# EAGLE design Data_Board_4_Panel (EAGLE 9.6.0)
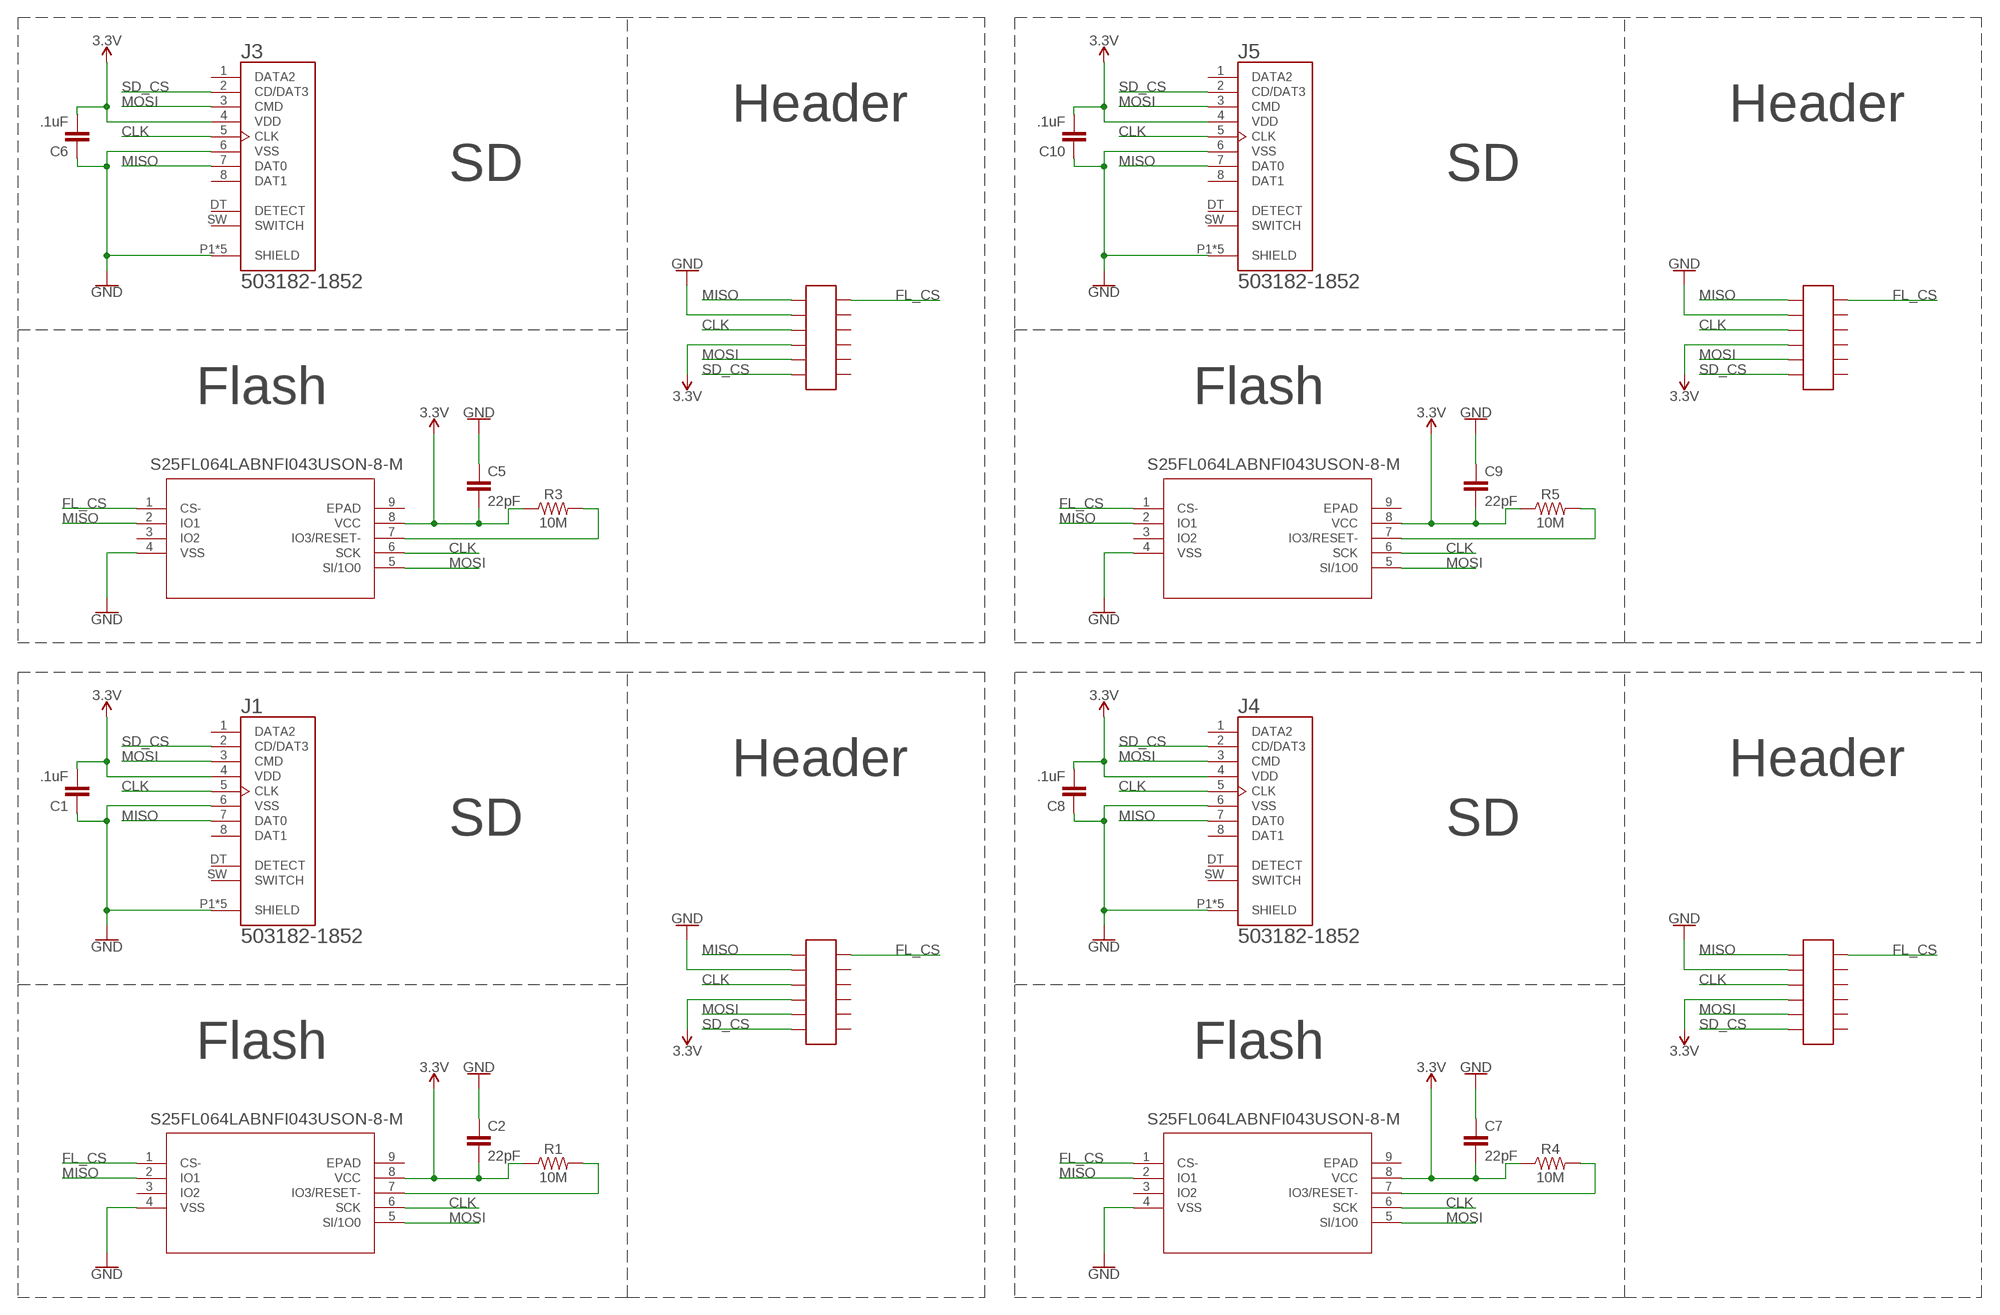
[diagram p0: schematic, sheet 1]

## Parts
C1  .1uF  10NF-0603-50V-10%  [0603]
C2  22pF  10NF-0603-50V-10%  [0603]
C5  22pF  10NF-0603-50V-10%  [0603]
C6  .1uF  10NF-0603-50V-10%  [0603]
C7  22pF  10NF-0603-50V-10%  [0603]
C8  .1uF  10NF-0603-50V-10%  [0603]
C9  22pF  10NF-0603-50V-10%  [0603]
C10  .1uF  10NF-0603-50V-10%  [0603]
J1  503182-1852  [MOLEX_503182-1852]
J3  503182-1852  [MOLEX_503182-1852]
J4  503182-1852  [MOLEX_503182-1852]
J5  503182-1852  [MOLEX_503182-1852]
R1  10M  220KOHM-0603-1/10W-1%  [0603]
R3  10M  220KOHM-0603-1/10W-1%  [0603]
R4  10M  220KOHM-0603-1/10W-1%  [0603]
R5  10M  220KOHM-0603-1/10W-1%  [0603]
U1  S25FL064LABNFI043USON-8-M  [USON-8-M]
U3  S25FL064LABNFI043USON-8-M  [USON-8-M]
U4  S25FL064LABNFI043USON-8-M  [USON-8-M]
U5  S25FL064LABNFI043USON-8-M  [USON-8-M]
U$1  12POS_HEADER  [12POS_HEADER]
U$3  12POS_HEADER  [12POS_HEADER]
U$4  12POS_HEADER  [12POS_HEADER]
U$5  12POS_HEADER  [12POS_HEADER]

## Nets
3.3V: C1.2 C2.2 C5.2 C6.2 C7.2 C8.2 C9.2 C10.2 J1.4(VDD) J3.4(VDD) J4.4(VDD) J5.4(VDD) R1.1 R3.1 R4.1 R5.1 U1.8(VCC) U3.8(VCC) U4.8(VCC) U5.8(VCC) U$1.P$4 U$3.P$4 U$4.P$4 U$5.P$4
CLK: J1.5(CLK) J3.5(CLK) J4.5(CLK) J5.5(CLK) U1.6(SCK) U3.6(SCK) U4.6(SCK) U5.6(SCK) U$1.P$3 U$3.P$3 U$4.P$3 U$5.P$3
FL_CS: U1.1(CS-) U3.1(CS-) U4.1(CS-) U5.1(CS-) U$1.P$12 U$3.P$12 U$4.P$12 U$5.P$12
GND: C1.1 C2.1 C5.1 C6.1 C7.1 C8.1 C9.1 C10.1 J1.6(VSS) J1.P1(SHIELD) J1.P2(SHIELD) J1.P3(SHIELD) J1.P4(SHIELD) J1.P5(SHIELD) J3.6(VSS) J3.P1(SHIELD) J3.P2(SHIELD) J3.P3(SHIELD) J3.P4(SHIELD) J3.P5(SHIELD) J4.6(VSS) J4.P1(SHIELD) J4.P2(SHIELD) J4.P3(SHIELD) J4.P4(SHIELD) J4.P5(SHIELD) J5.6(VSS) J5.P1(SHIELD) J5.P2(SHIELD) J5.P3(SHIELD) J5.P4(SHIELD) J5.P5(SHIELD) U1.4(VSS) U3.4(VSS) U4.4(VSS) U5.4(VSS) U$1.P$2 U$3.P$2 U$4.P$2 U$5.P$2
MISO: J1.7(DAT0) J3.7(DAT0) J4.7(DAT0) J5.7(DAT0) U1.2(IO1) U3.2(IO1) U4.2(IO1) U5.2(IO1) U$1.P$1 U$3.P$1 U$4.P$1 U$5.P$1
MOSI: J1.3(CMD) J3.3(CMD) J4.3(CMD) J5.3(CMD) U1.5(SI/1O0) U3.5(SI/1O0) U4.5(SI/1O0) U5.5(SI/1O0) U$1.P$5 U$3.P$5 U$4.P$5 U$5.P$5
N$2: R3.2 U3.7(IO3/RESET-)
N$3: R4.2 U4.7(IO3/RESET-)
N$4: R5.2 U5.7(IO3/RESET-)
N$6: R1.2 U1.7(IO3/RESET-)
SD_CS: J1.2(CD/DAT3) J3.2(CD/DAT3) J4.2(CD/DAT3) J5.2(CD/DAT3) U$1.P$6 U$3.P$6 U$4.P$6 U$5.P$6
Unconnected: J1.1(DATA2) J1.8(DAT1) J1.DT(DETECT) J1.SW(SWITCH) J3.1(DATA2) J3.8(DAT1) J3.DT(DETECT) J3.SW(SWITCH) J4.1(DATA2) J4.8(DAT1) J4.DT(DETECT) J4.SW(SWITCH) J5.1(DATA2) J5.8(DAT1) J5.DT(DETECT) J5.SW(SWITCH) U1.3(IO2) U1.9(EPAD) U3.3(IO2) U3.9(EPAD) U4.3(IO2) U4.9(EPAD) U5.3(IO2) U5.9(EPAD) U$1.P$7 U$1.P$8 U$1.P$9 U$1.P$10 U$1.P$11 U$3.P$7 U$3.P$8 U$3.P$9 U$3.P$10 U$3.P$11 U$4.P$7 U$4.P$8 U$4.P$9 U$4.P$10 U$4.P$11 U$5.P$7 U$5.P$8 U$5.P$9 U$5.P$10 U$5.P$11

## Notes on the sheet
- Header | Header
- SD | SD
- Flash | Flash
- Header | Header
- SD | SD
- Flash | Flash

## Library data of the parts
C1 C2 C5-C10 = SparkFun-Capacitors:10NF: 0.01uF/10nF/10,000pF ceramic capacitors A capacitor is a passive two-terminal electrical component used to store electrical energy temporarily in an electric field. CAP-09321; PROD_ID: CAP-00867; VALUE: 10nF
J1 J3-J5 = 503182-1852:503182-1852: Conn Micro SD Card M 8 POS 1.09mm Solder RA SMD Embossed T/R 0.5A/Contact; DESCRIPTION: 10 (8 + 2) Position Card Connector microSD™ Surface Mount, Right Angle Gold; DIGI-KEY_PART_NUMBER: WM12834CT-ND; MF: Molex; MP: 5031821852; PACKAGE: None; PURCHASE-URL: https://pricing.snapeda.com/search/part/5031821852/?ref=eda
R1 R3-R5 = SparkFun-Resistors:220KOHM: 220kΩ resistor A resistor is a passive two-terminal electrical component that implements electrical resistance as a circuit element. Resistors act to reduce current flow, and, at the same time, act to lower voltage levels within circuits. - Wikipedia; PROD_ID: RES-08969; VALUE: 220k
U1 U3-U5 = S25FL064LABNFI043-Flash:S25FL064LABNFI043; BUILT_BY: EMA_Jessica; COPYRIGHT: Copyright (C) 2018 Accelerated Designs. All rights reserved; MANUFACTURER_PART_NUMBER: S25FL064LABNFI043; SOURCELIBRARY: Cypress_Semiconductor_2019-12-17; VENDOR: Cypress Semiconductor
U$1 U$3-U$5 = a4e-axe-connectors:12POS_HEADER

## Board
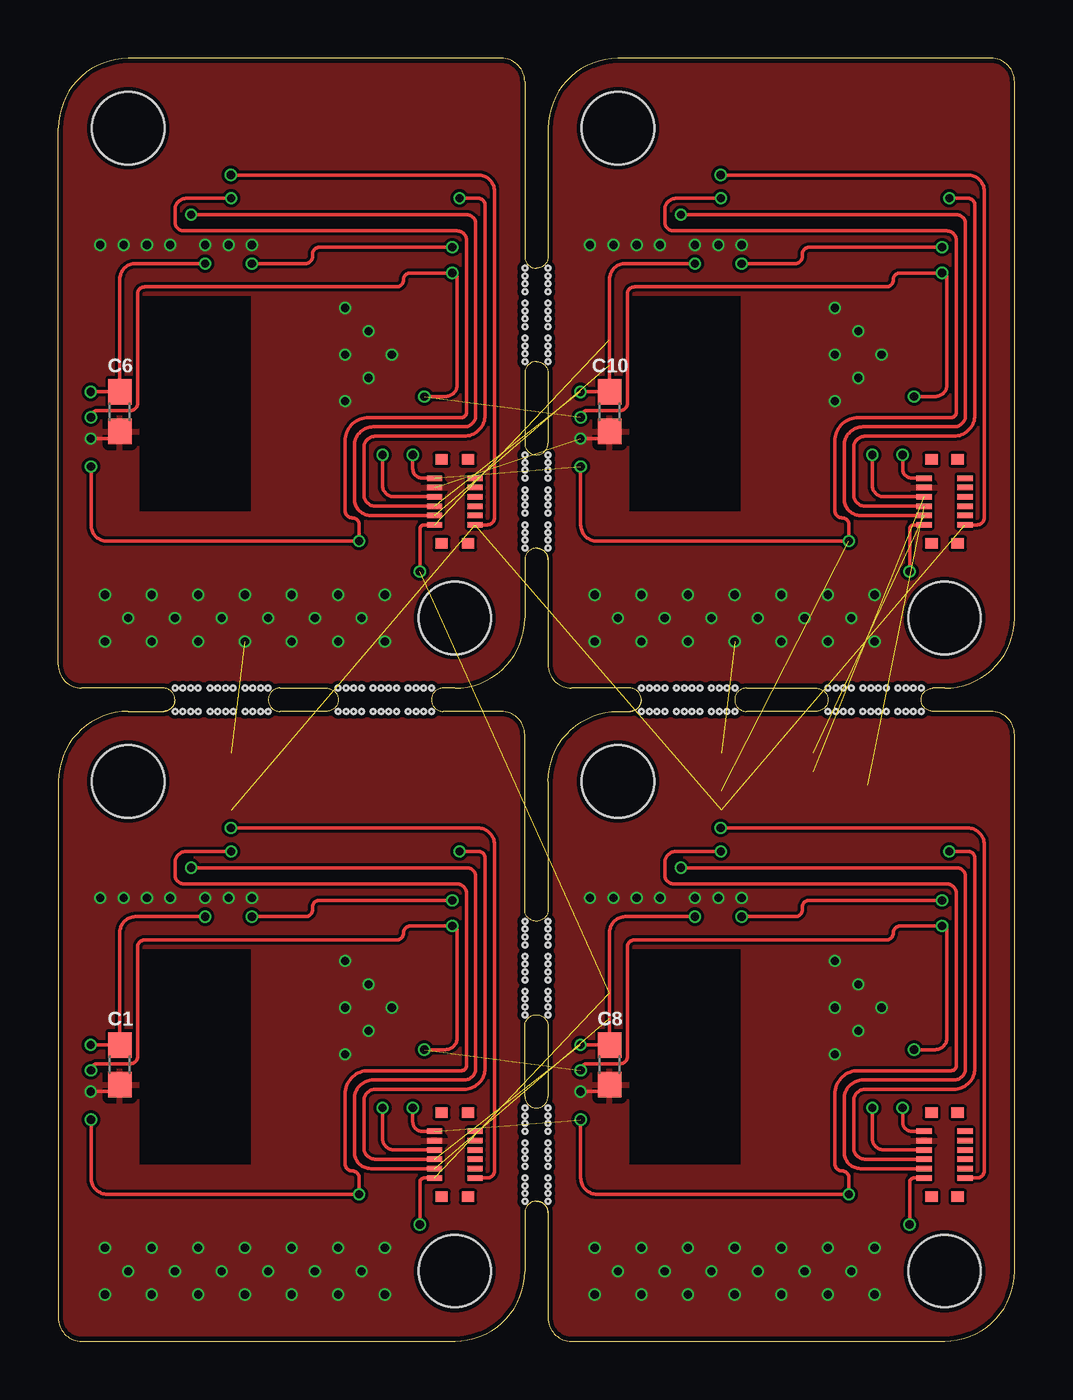
[diagram p1: board, top side]
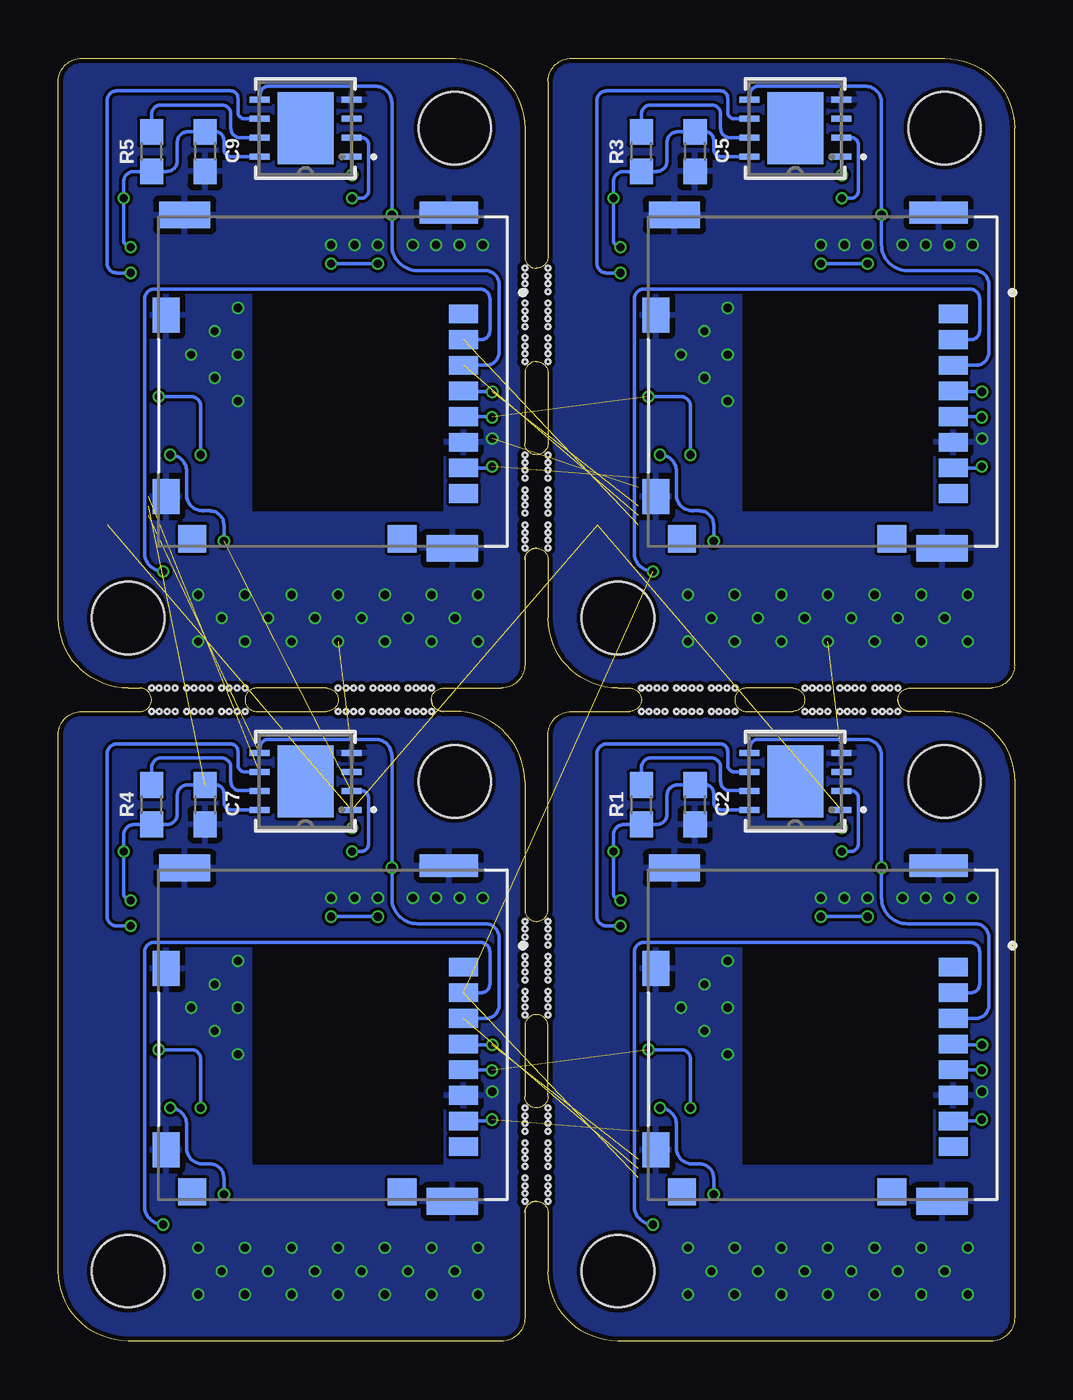
[diagram p2: board, bottom side, seen from below]

Size 41 x 55 mm. Coordinates in mm from the lower left corner, seen from the top.
Outline: 4.5,27 3,27 arc90 0,24 0,1 arc90 1,0 17,0 arc90 20,3 20,5.5 arc-90 20.5,6
Outline: 4.5,27 arc90 5,27.5
Outline: 5,27.5 arc-90 4.5,27
Outline: 24.5,27 arc90 25,27.5
Outline: 25,27.5 arc90 24.5,28 22,28 arc-90 21,29 21,33.5
Outline: 25,27.5 arc-90 24.5,27
Outline: 24.5,27 24,27 arc90 21,24 21,18.5 arc-90 20.5,18 arc-90 20,18.5 20,26 arc90 19,27 16.5,27 arc-90 16,27.5 arc-90 16.5,28 17,28 arc90 20,31 20,33.5 arc-90 20.5,34
Outline: 21,33.5 arc90 20.5,34
Outline: 20.5,34 arc-90 21,33.5
Outline: 21,5.5 arc90 20.5,6
Outline: 20.5,6 arc-90 21,5.5
Outline: 21,5.5 21,1 arc90 22,0 38,0 arc90 41,3 41,26 arc90 40,27 37.5,27 arc-90 37,27.5 arc-90 37.5,28 38,28 arc90 41,31 41,54 arc90 40,55 24,55 arc90 21,52 21,46.5 arc-90 20.5,46 arc-90 20,46.5 20,54 arc90 19,55 3,55 arc90 0,52 0,29 arc90 1,28 4.5,28 arc-90 5,27.5
Outline: 9,27.5 arc90 9.5,27 11.5,27 arc90 12,27.5 arc90 11.5,28 9.5,28 arc90 9,27.5
Outline: 29.5,28 arc90 29,27.5 arc90 29.5,27 32.5,27 arc90 33,27.5 arc90 32.5,28 29.5,28
Outline: 20.5,38 arc90 21,38.5 21,41.5 arc90 20.5,42 arc90 20,41.5 20,38.5 arc90 20.5,38
Outline: 20,10.5 arc90 20.5,10 arc90 21,10.5 21,13.5 arc90 20.5,14 arc90 20,13.5 20,10.5
Copper layers (1*16): Top 0.035559375mm / dielectric 1.6mm / Bottom 0.035559375mm
Design rules "jlcpcb2layer *": minimum track width 5mil, minimum drill 12mil, track to track 5mil, track to pad 5mil, pad to pad 5mil, via to via 5mil, smd to smd 5mil, copper to edge 8mil, drill to drill 6mil, minimum pad ring 5mil, minimum via ring 3mil, stop-mask expansion 2.5mil, vias tented up to drill 20mil, thermal gap 10mil
Holes 3.1 mm at 3,24 17,3 3,52 17,31 24,52 38,31 24,24 38,3
Holes 0.2 mm at 6,27 5,27 5.67,27 5.34,27 9,27 8,27 8.67,27 8.34,27 7.5,27 6.5,27 7.17,27 6.84,27 13,27 12,27 12.67,27 12.34,27 16,27 15,27 15.67,27 15.34,27 14.5,27 13.5,27 14.17,27 13.84,27 26,28 25,28 25.67,28 25.34,28 26,27 25,27 25.67,27 25.34,27 29,28 28,28 28.67,28 28.34,28 29,27 28,27 28.67,27 28.34,27 27.5,28 26.5,28 27.17,28 26.84,28 27.5,27 26.5,27 27.17,27 26.84,27 34,28 33,28 33.67,28 33.34,28 34,27 33,27 33.67,27 33.34,27 37,28 36,28 36.67,28 36.34,28 37,27 36,27 36.67,27 36.34,27 35.5,28 34.5,28 35.17,28 34.84,28 35.5,27 34.5,27 35.17,27 34.84,27 21,35 21,34 21,34.67 21,34.34 21,38 21,37 21,37.67 21,37.34 21,36.5 21,35.5 21,36.17 21,35.84 21,43 21,42 21,42.67 21,42.34 21,46 21,45 21,45.67 21,45.34 21,44.5 21,43.5 21,44.17 21,43.84 20,7 20,6 20,6.67 20,6.34 21,7 21,6 21,6.67 21,6.34 20,10 20,9 20,9.67 20,9.34 21,10 21,9 21,9.67 21,9.34 20,8.5 20,7.5 20,8.17 20,7.84 21,8.5 21,7.5 21,8.17 21,7.84 20,15 20,14 20,14.67 20,14.34 21,15 21,14 21,14.67 21,14.34 20,18 20,17 20,17.67 20,17.34 21,18 21,17 21,17.67 21,17.34 20,16.5 20,15.5 20,16.17 20,15.84 21,16.5 21,15.5 21,16.17 21,15.84 6,28 5,28 5.67,28 5.34,28 9,28 8,28 8.67,28 8.34,28 7.5,28 6.5,28 7.17,28 6.84,28 13,28 12,28 12.67,28 12.34,28 16,28 15,28 15.67,28 15.34,28 14.5,28 13.5,28 14.17,28 13.84,28 20,35 20,34 20,34.67 20,34.34 20,38 20,37 20,37.67 20,37.34 20,36.5 20,35.5 20,36.17 20,35.84 20,43 20,42 20,42.67 20,42.34 20,46 20,45 20,45.67 20,45.34 20,44.5 20,43.5 20,44.17 20,43.84

### Footprints (pad centres in the part's own frame; a part is rotated, then mirrored left to right if it is on the bottom)
0603 = smd 1.1 x 1: 1 -0.85,0; 2 0.85,0
MOLEX_503182-1852 = smd 0.8 x 1.24: 1 -2.9,6.355; 2 -1.8,6.355; 3 -0.7,6.355; 4 0.4,6.355; 5 1.5,6.355; 6 2.6,6.355; 7 3.7,6.355; 8 4.8,6.355 | smd 1.16 x 1.2: DT 6.74,-5.275 | smd 0.95 x 2.5: P1 -7.245,5.725 | smd 1.15 x 2.2: P2 7.145,5.875; P3 -7.145,-5.605 | smd 1.5 x 1.15: P4 -2.84,-6.4; P5 4.94,-6.4 | smd 1.16 x 1.25: SW 6.74,3.725
USON-8-M = smd 0.864 x 0.254: 1 -1.968,1.219; 2 -1.968,0.406; 3 -1.968,-0.406; 4 -1.968,-1.219; 5 1.968,-1.219; 6 1.968,-0.406; 7 1.968,0.406; 8 1.968,1.219 | smd 2.388 x 3.099: 9 0,0
12POS_HEADER = smd 0.65 x 0.23: P$1 -0.875,1; P$2 -0.875,0.6; P$3 -0.875,0.2; P$4 -0.875,-0.2; P$5 -0.875,-0.6; P$6 -0.875,-1; P$7 0.875,1; P$8 0.875,0.6; P$9 0.875,0.2; P$10 0.875,-0.2; P$11 0.875,-0.6; P$12 0.875,-1 | smd 0.53 x 0.45: P$13 -0.565,-1.8; P$14 0.565,-1.8; P$15 -0.565,1.8; P$16 0.565,1.8

### Placement (x,y rotation side)
C1  2.64,11.85 90 top
C2  13.7,23 90 bottom
C5  13.7,51 90 bottom
C6  2.64,39.85 90 top
C7  34.7,23 90 bottom
C8  23.64,11.85 90 top
C9  34.7,51 90 bottom
C10  23.64,39.85 90 top
J1  8.98,13.14 270 bottom
J3  8.98,41.14 270 bottom
J4  29.98,13.14 270 bottom
J5  29.98,41.14 270 bottom
R1  16,23 90 bottom
R3  16,51 90 bottom
R4  37,23 90 bottom
R5  37,51 90 bottom
U1  9.4,24 180 bottom
U3  9.4,52 180 bottom
U4  30.4,24 180 bottom
U5  30.4,52 180 bottom
U$1  17,8 0 top
U$3  17,36 0 top
U$4  38,8 0 top
U$5  38,36 0 top

### Tracks (layer width: path | path; a pad name or v marks a point on that pad's centre or on a via)
3.3V  (via drill 0.35)  (3 unrouted)
  Top 0.152: v1.39,12.7 C1.2 2.64,17.54 arc-90 3.3,18.2 v6.3,18.2 | U$1.P$4 13.6,7.8 arc-90 13.1,8.3 13.1,10.3 arc-90 13.6,10.8 17.4,10.8 arc90 18.3,11.7 18.3,20.7 arc90 18,21 v17.2,21 | v8.3,18.2 10.6,18.2 arc90 10.9,18.5 10.9,18.6 arc-90 11.2,18.9 v16.89,18.9 | v1.39,40.7 C6.2 2.64,45.54 arc-90 3.3,46.2 v6.3,46.2 | U$3.P$4 13.6,35.8 arc-90 13.1,36.3 13.1,38.3 arc-90 13.6,38.8 17.4,38.8 arc90 18.3,39.7 18.3,48.7 arc90 18,49 v17.2,49 | v8.3,46.2 10.6,46.2 arc90 10.9,46.5 10.9,46.6 arc-90 11.2,46.9 v16.89,46.9 | v22.39,40.7 C10.2 23.64,45.54 arc-90 24.3,46.2 v27.3,46.2 | U$5.P$4 34.6,35.8 arc-90 34.1,36.3 34.1,38.3 arc-90 34.6,38.8 38.4,38.8 arc90 39.3,39.7 39.3,48.7 arc90 39,49 v38.2,49 | v29.3,46.2 31.6,46.2 arc90 31.9,46.5 31.9,46.6 arc-90 32.2,46.9 v37.89,46.9 | v22.39,12.7 C8.2 23.64,17.54 arc-90 24.3,18.2 v27.3,18.2 | U$4.P$4 34.6,7.8 arc-90 34.1,8.3 34.1,10.3 arc-90 34.6,10.8 38.4,10.8 arc90 39.3,11.7 39.3,20.7 arc90 39,21 v38.2,21 | v29.3,18.2 31.6,18.2 arc90 31.9,18.5 31.9,18.6 arc-90 32.2,18.9 v37.89,18.9
  Bottom 0.152: J1.4 2.58,12.7 v1.39,12.7 | U1.8 12.58,22.78 arc90 12.9,23.1 12.9,23.5 arc-90 13.25,23.85 C2.2 14.45,23.85 arc-90 14.9,23.4 14.9,22.6 arc90 15.35,22.15 R1.1 16.75,22.15 arc-90 17.2,21.7 v17.2,21 17.2,19.21 arc-90 v16.89,18.9 | v6.3,18.2 v8.3,18.2 | J3.4 2.58,40.7 v1.39,40.7 | U3.8 12.58,50.78 arc90 12.9,51.1 12.9,51.5 arc-90 13.25,51.85 C5.2 14.45,51.85 arc-90 14.9,51.4 14.9,50.6 arc90 15.35,50.15 R3.1 16.75,50.15 arc-90 17.2,49.7 v17.2,49 17.2,47.21 arc-90 v16.89,46.9 | v6.3,46.2 v8.3,46.2 | J5.4 23.59,40.7 v22.39,40.7 | U5.8 33.58,50.78 arc90 33.9,51.1 33.9,51.5 arc-90 34.25,51.85 C9.2 35.45,51.85 arc-90 35.9,51.4 35.9,50.6 arc90 36.35,50.15 R5.1 37.75,50.15 arc-90 38.2,49.7 v38.2,49 38.2,47.21 arc-90 v37.89,46.9 | v27.3,46.2 v29.3,46.2 | J4.4 23.59,12.7 v22.39,12.7 | U4.8 33.58,22.78 arc90 33.9,23.1 33.9,23.5 arc-90 34.25,23.85 C7.2 35.45,23.85 arc-90 35.9,23.4 35.9,22.6 arc90 36.35,22.15 R4.1 37.75,22.15 arc-90 38.2,21.7 v38.2,21 38.2,19.21 arc-90 v37.89,18.9 | v27.3,18.2 v29.3,18.2
CLK  (via drill 0.35)  (3 unrouted)
  Top 0.152: U$1.P$3 14.4,8.2 arc-90 13.9,8.7 v13.9,10 | v15.69,12.5 16.6,12.5 arc90 17.1,13 17.1,17.59 arc90 v16.89,17.8 15.1,17.8 arc90 14.8,17.5 arc-90 14.5,17.2 3.7,17.2 arc90 3.4,16.9 3.4,12.2 arc-90 3.1,11.9 1.69,11.9 arc90 v1.4,11.61 | U$3.P$3 14.4,36.2 arc-90 13.9,36.7 v13.9,38 | v15.69,40.5 16.6,40.5 arc90 17.1,41 17.1,45.59 arc90 v16.89,45.8 15.1,45.8 arc90 14.8,45.5 arc-90 14.5,45.2 3.7,45.2 arc90 3.4,44.9 3.4,40.2 arc-90 3.1,39.9 1.69,39.9 arc90 v1.4,39.61 | U$5.P$3 35.4,36.2 arc-90 34.9,36.7 v34.9,38 | v36.69,40.5 37.6,40.5 arc90 38.1,41 38.1,45.59 arc90 v37.89,45.8 36.1,45.8 arc90 35.8,45.5 arc-90 35.5,45.2 24.7,45.2 arc90 24.4,44.9 24.4,40.2 arc-90 24.1,39.9 22.69,39.9 arc90 v22.4,39.61 | U$4.P$3 35.4,8.2 arc-90 34.9,8.7 v34.9,10 | v36.69,12.5 37.6,12.5 arc90 38.1,13 38.1,17.59 arc90 v37.89,17.8 36.1,17.8 arc90 35.8,17.5 arc-90 35.5,17.2 24.7,17.2 arc90 24.4,16.9 24.4,12.2 arc-90 24.1,11.9 22.69,11.9 arc90 v22.4,11.61
  Bottom 0.152: U1.6 12.01,24.41 arc90 12.3,24.7 12.3,25.3 arc-90 12.6,25.6 17.5,25.6 arc-90 17.9,25.2 17.9,18.2 arc-90 17.5,17.8 v16.89,17.8 | J1.5 1.43,11.64 arc90 v1.4,11.61 | v13.9,10 13.9,12.1 arc-90 14.3,12.5 v15.69,12.5 | U3.6 12.01,52.41 arc90 12.3,52.7 12.3,53.3 arc-90 12.6,53.6 17.5,53.6 arc-90 17.9,53.2 17.9,46.2 arc-90 17.5,45.8 v16.89,45.8 | J3.5 1.43,39.64 arc90 v1.4,39.61 | v13.9,38 13.9,40.1 arc-90 14.3,40.5 v15.69,40.5 | U5.6 33.01,52.41 arc90 33.3,52.7 33.3,53.3 arc-90 33.6,53.6 38.5,53.6 arc-90 38.9,53.2 38.9,46.2 arc-90 38.5,45.8 v37.89,45.8 | J5.5 22.43,39.64 arc90 v22.4,39.61 | v34.9,38 34.9,40.1 arc-90 35.3,40.5 v36.69,40.5 | U4.6 33.01,24.41 arc90 33.3,24.7 33.3,25.3 arc-90 33.6,25.6 38.5,25.6 arc-90 38.9,25.2 38.9,18.2 arc-90 38.5,17.8 v37.89,17.8 | J4.5 22.43,11.64 arc90 v22.4,11.61 | v34.9,10 34.9,12.1 arc-90 35.3,12.5 v36.69,12.5
FL_CS  (via drill 0.35)  (3 unrouted)
  Top 0.152: U$1.P$12 18.4,7 arc90 18.7,7.3 18.7,21.3 arc90 18,22 v7.4,22 | U$3.P$12 18.4,35 arc90 18.7,35.3 18.7,49.3 arc90 18,50 v7.4,50 | U$5.P$12 39.4,35 arc90 39.7,35.3 39.7,49.3 arc90 39,50 v28.4,50 | U$4.P$12 39.4,7 arc90 39.7,7.3 39.7,21.3 arc90 39,22 v28.4,22
  Bottom 0.152: v7.4,22 7.4,22.75 arc-90 U1.1 | v7.4,50 7.4,50.75 arc-90 U3.1 | v28.4,50 28.4,50.75 arc-90 U5.1 | v28.4,22 28.4,22.75 arc-90 U4.1
GND  (via drill 0.35)  (3 unrouted)
  Top 0.152: C1.1 2.34,10.7 v1.39,10.7 | C6.1 2.34,38.7 v1.39,38.7 | C10.1 23.34,38.7 v22.39,38.7 | C8.1 23.34,10.7 v22.39,10.7
  other vias: 1.8,19 2.8,19 3.8,19 4.8,19 2,2 2,4 3,3 5,3 4,4 4,2 6,2 6,4 7,3 8,4 8,2 9,3 10,4 12,4 11,3 10,2 12,2 13,3 14,4 14,2 12.3,16.3 13.3,15.3 12.3,14.3 14.3,14.3 13.3,13.3 12.3,12.3 6.3,19 7.3,19 8.3,19 1.8,47 2.8,47 3.8,47 4.8,47 2,30 2,32 3,31 5,31 4,32 4,30 6,30 6,32 7,31 8,32 8,30 9,31 10,32 12,32 11,31 10,30 12,30 13,31 14,32 14,30 12.3,44.3 13.3,43.3 12.3,42.3 14.3,42.3 13.3,41.3 12.3,40.3 6.3,47 7.3,47 8.3,47 22.8,47 23.8,47 24.8,47 25.8,47 23,30 23,32 24,31 26,31 25,32 25,30 27,30 27,32 28,31 29,32 29,30 30,31 31,32 33,32 32,31 31,30 33,30 34,31 35,32 35,30 33.3,44.3 34.3,43.3 33.3,42.3 35.3,42.3 34.3,41.3 33.3,40.3 27.3,47 28.3,47 29.3,47 22.8,19 23.8,19 24.8,19 25.8,19 23,2 23,4 24,3 26,3 25,4 25,2 27,2 27,4 28,3 29,4 29,2 30,3 31,4 33,4 32,3 31,2 33,2 34,3 35,4 35,2 33.3,16.3 34.3,15.3 33.3,14.3 35.3,14.3 34.3,13.3 33.3,12.3 27.3,19 28.3,19 29.3,19
  pour Bottom: 20,27 20,0 0,0 0,27
  pour Top: 0,27 20,27 20,0 0,0
  pour Bottom: 20,55 20,28 0,28 0,55
  pour Top: 0,55 20,55 20,28 0,28
  pour Bottom: 41,55 41,28 21,28 21,55
  pour Top: 21,55 41,55 41,28 21,28
  pour Bottom: 41,27 41,0 21,0 21,27
  pour Top: 21,27 41,27 41,0 21,0
MISO  (via drill 0.35)  (3 unrouted)
  Top 0.152: U$1.P$1 15.6,9 arc-90 15.2,9.4 v15.2,10 | v1.4,9.5 1.4,7 arc90 2.1,6.3 v12.9,6.3 12.9,7 arc90 12.6,7.3 arc-90 12.3,7.6 12.3,10.6 arc-90 13.3,11.6 17.3,11.6 arc90 17.5,11.8 17.5,19.2 arc90 17.1,19.6 5.4,19.6 arc-90 5,20 5,20.5 arc-90 5.5,21 v7.41,21 | U$3.P$1 15.6,37 arc-90 15.2,37.4 v15.2,38 | v1.4,37.5 1.4,35 arc90 2.1,34.3 v12.9,34.3 12.9,35 arc90 12.6,35.3 arc-90 12.3,35.6 12.3,38.6 arc-90 13.3,39.6 17.3,39.6 arc90 17.5,39.8 17.5,47.2 arc90 17.1,47.6 5.4,47.6 arc-90 5,48 5,48.5 arc-90 5.5,49 v7.41,49 | U$5.P$1 36.6,37 arc-90 36.2,37.4 v36.2,38 | v22.4,37.5 22.4,35 arc90 23.1,34.3 v33.9,34.3 33.9,35 arc90 33.6,35.3 arc-90 33.3,35.6 33.3,38.6 arc-90 34.3,39.6 38.3,39.6 arc90 38.5,39.8 38.5,47.2 arc90 38.1,47.6 26.4,47.6 arc-90 26,48 26,48.5 arc-90 26.5,49 v28.41,49 | U$4.P$1 36.6,9 arc-90 36.2,9.4 v36.2,10 | v22.4,9.5 22.4,7 arc90 23.1,6.3 v33.9,6.3 33.9,7 arc90 33.6,7.3 arc-90 33.3,7.6 33.3,10.6 arc-90 34.3,11.6 38.3,11.6 arc90 38.5,11.8 38.5,19.2 arc90 38.1,19.6 26.4,19.6 arc-90 26,20 26,20.5 arc-90 26.5,21 v28.41,21
  Bottom 0.152: v1.4,9.5 arc90 1.46,9.44 J1.7 | v12.9,6.3 12.9,7 arc-90 13.5,7.6 13.8,7.6 arc90 14.5,8.3 14.5,9.3 arc-90 v15.2,10 | U1.2 arc90 U1.2 7,23.6 arc90 6.7,23.3 6.7,21.31 arc90 7.01,21 v7.41,21 | v1.4,37.5 arc90 1.46,37.44 J3.7 | v12.9,34.3 12.9,35 arc-90 13.5,35.6 13.8,35.6 arc90 14.5,36.3 14.5,37.3 arc-90 v15.2,38 | U3.2 arc90 U3.2 7,51.6 arc90 6.7,51.3 6.7,49.31 arc90 7.01,49 v7.41,49 | v22.4,37.5 arc90 22.46,37.44 J5.7 | v33.9,34.3 33.9,35 arc-90 34.5,35.6 34.8,35.6 arc90 35.5,36.3 35.5,37.3 arc-90 v36.2,38 | U5.2 arc90 U5.2 28,51.6 arc90 27.7,51.3 27.7,49.31 arc90 28.01,49 v28.41,49 | v22.4,9.5 arc90 22.46,9.44 J4.7 | v33.9,6.3 33.9,7 arc-90 34.5,7.6 34.8,7.6 arc90 35.5,8.3 35.5,9.3 arc-90 v36.2,10 | U4.2 arc90 U4.2 28,23.6 arc90 27.7,23.3 27.7,21.31 arc90 28.01,21 v28.41,21
MOSI  (via drill 0.35)  (3 unrouted)
  Top 0.152: U$1.P$5 13.4,7.4 arc-90 12.7,8.1 12.7,10.4 arc-90 13.5,11.2 17.4,11.2 arc90 17.9,11.7 17.9,19.9 arc90 17.5,20.3 v5.7,20.3 | U$3.P$5 13.4,35.4 arc-90 12.7,36.1 12.7,38.4 arc-90 13.5,39.2 17.4,39.2 arc90 17.9,39.7 17.9,47.9 arc90 17.5,48.3 v5.7,48.3 | U$5.P$5 34.4,35.4 arc-90 33.7,36.1 33.7,38.4 arc-90 34.5,39.2 38.4,39.2 arc90 38.9,39.7 38.9,47.9 arc90 38.5,48.3 v26.7,48.3 | U$4.P$5 34.4,7.4 arc-90 33.7,8.1 33.7,10.4 arc-90 34.5,11.2 38.4,11.2 arc90 38.9,11.7 38.9,19.9 arc90 38.5,20.3 v26.7,20.3
  Bottom 0.152: J1.3 1.66,13.84 arc-90 1.1,14.4 1.1,17.3 arc-90 1.7,17.9 4.6,17.9 arc90 5.7,19 v5.7,20.3 5.7,25.1 arc-90 6.4,25.8 11,25.8 arc-90 11.34,25.46 U1.5 | J3.3 1.66,41.84 arc-90 1.1,42.4 1.1,45.3 arc-90 1.7,45.9 4.6,45.9 arc90 5.7,47 v5.7,48.3 5.7,53.1 arc-90 6.4,53.8 11,53.8 arc-90 11.34,53.46 U3.5 | J5.3 22.66,41.84 arc-90 22.1,42.4 22.1,45.3 arc-90 22.7,45.9 25.6,45.9 arc90 26.7,47 v26.7,48.3 26.7,53.1 arc-90 27.4,53.8 32,53.8 arc-90 32.34,53.46 U5.5 | J4.3 22.66,13.84 arc-90 22.1,14.4 22.1,17.3 arc-90 22.7,17.9 25.6,17.9 arc90 26.7,19 v26.7,20.3 26.7,25.1 arc-90 27.4,25.8 32,25.8 arc-90 32.34,25.46 U4.5
N$2
  Bottom 0.152: U3.7 arc-90 U3.7 12.2,51.6 arc90 12.6,52 12.6,52.6 arc-90 13,53 15.6,53 arc-90 16,52.6 R3.2
N$3
  Bottom 0.152: U4.7 arc-90 U4.7 33.2,23.6 arc90 33.6,24 33.6,24.6 arc-90 34,25 36.6,25 arc-90 37,24.6 R4.2
N$4
  Bottom 0.152: U5.7 arc-90 U5.7 33.2,51.6 arc90 33.6,52 33.6,52.6 arc-90 34,53 36.6,53 arc-90 37,52.6 R5.2
N$6
  Bottom 0.152: U1.7 arc-90 U1.7 12.2,23.6 arc90 12.6,24 12.6,24.6 arc-90 13,25 15.6,25 arc-90 16,24.6 R1.2
SD_CS  (via drill 0.35)  (3 unrouted)
  Top 0.152: U$1.P$6 15.7,7 arc90 15.5,6.8 v15.5,5 | U$3.P$6 15.7,35 arc90 15.5,34.8 v15.5,33 | U$5.P$6 36.7,35 arc90 36.5,34.8 v36.5,33 | U$4.P$6 36.7,7 arc90 36.5,6.8 v36.5,5
  Bottom 0.152: J1.2 1.86,14.94 arc-90 1.5,15.3 1.5,16.7 arc-90 1.9,17.1 15.9,17.1 arc-90 16.3,16.7 16.3,5.8 arc-90 v15.5,5 | J3.2 1.86,42.94 arc-90 1.5,43.3 1.5,44.7 arc-90 1.9,45.1 15.9,45.1 arc-90 16.3,44.7 16.3,33.8 arc-90 v15.5,33 | J5.2 22.86,42.94 arc-90 22.5,43.3 22.5,44.7 arc-90 22.9,45.1 36.9,45.1 arc-90 37.3,44.7 37.3,33.8 arc-90 v36.5,33 | J4.2 22.86,14.94 arc-90 22.5,15.3 22.5,16.7 arc-90 22.9,17.1 36.9,17.1 arc-90 37.3,16.7 37.3,5.8 arc-90 v36.5,5